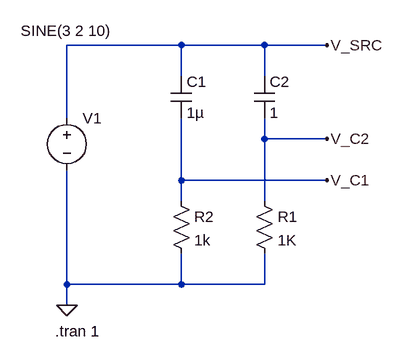
[diagram p0: schematic electronics_capacitors_reactance_dampens_amplitude.asc]
electronics_capacitors_reactance_dampens_amplitude.asc, the LTspice schematic file:
Version 4
SHEET 1 880 680
WIRE 240 96 64 96
WIRE 368 96 240 96
WIRE 464 96 368 96
WIRE 240 144 240 96
WIRE 368 144 368 96
WIRE 64 208 64 96
WIRE 368 240 368 208
WIRE 464 240 368 240
WIRE 240 304 240 208
WIRE 464 304 240 304
WIRE 240 336 240 304
WIRE 368 336 368 240
WIRE 64 464 64 288
WIRE 240 464 240 416
WIRE 240 464 64 464
WIRE 368 464 368 416
WIRE 368 464 240 464
WIRE 64 496 64 464
FLAG 64 496 0
FLAG 464 96 V_SRC
FLAG 464 240 V_C2
FLAG 464 304 V_C1
SYMBOL voltage 64 192 R0
WINDOW 3 -71 -118 Left 2
WINDOW 123 0 0 Left 0
WINDOW 39 0 0 Left 0
SYMATTR InstName V1
SYMATTR Value SINE(3 2 10)
SYMBOL cap 224 144 R0
SYMATTR InstName C1
SYMATTR Value 1µ
SYMBOL res 352 320 R0
SYMATTR InstName R1
SYMATTR Value 1K
SYMBOL res 224 320 R0
SYMATTR InstName R2
SYMATTR Value 1k
SYMBOL cap 352 144 R0
SYMATTR InstName C2
SYMATTR Value 1
TEXT 46 536 Left 2 !.tran 1

The netlist it stands for:
* electronics_capacitors_reactance_dampens_amplitude.asc
V1 V_SRC 0 SINE(3 2 10)
C1 V_SRC V_C1 1µ
R1 V_C2 0 1K
R2 V_C1 0 1k
C2 V_SRC V_C2 1
.tran 1
.backanno
.end